# EAGLE design untitled (EAGLE 6.3)
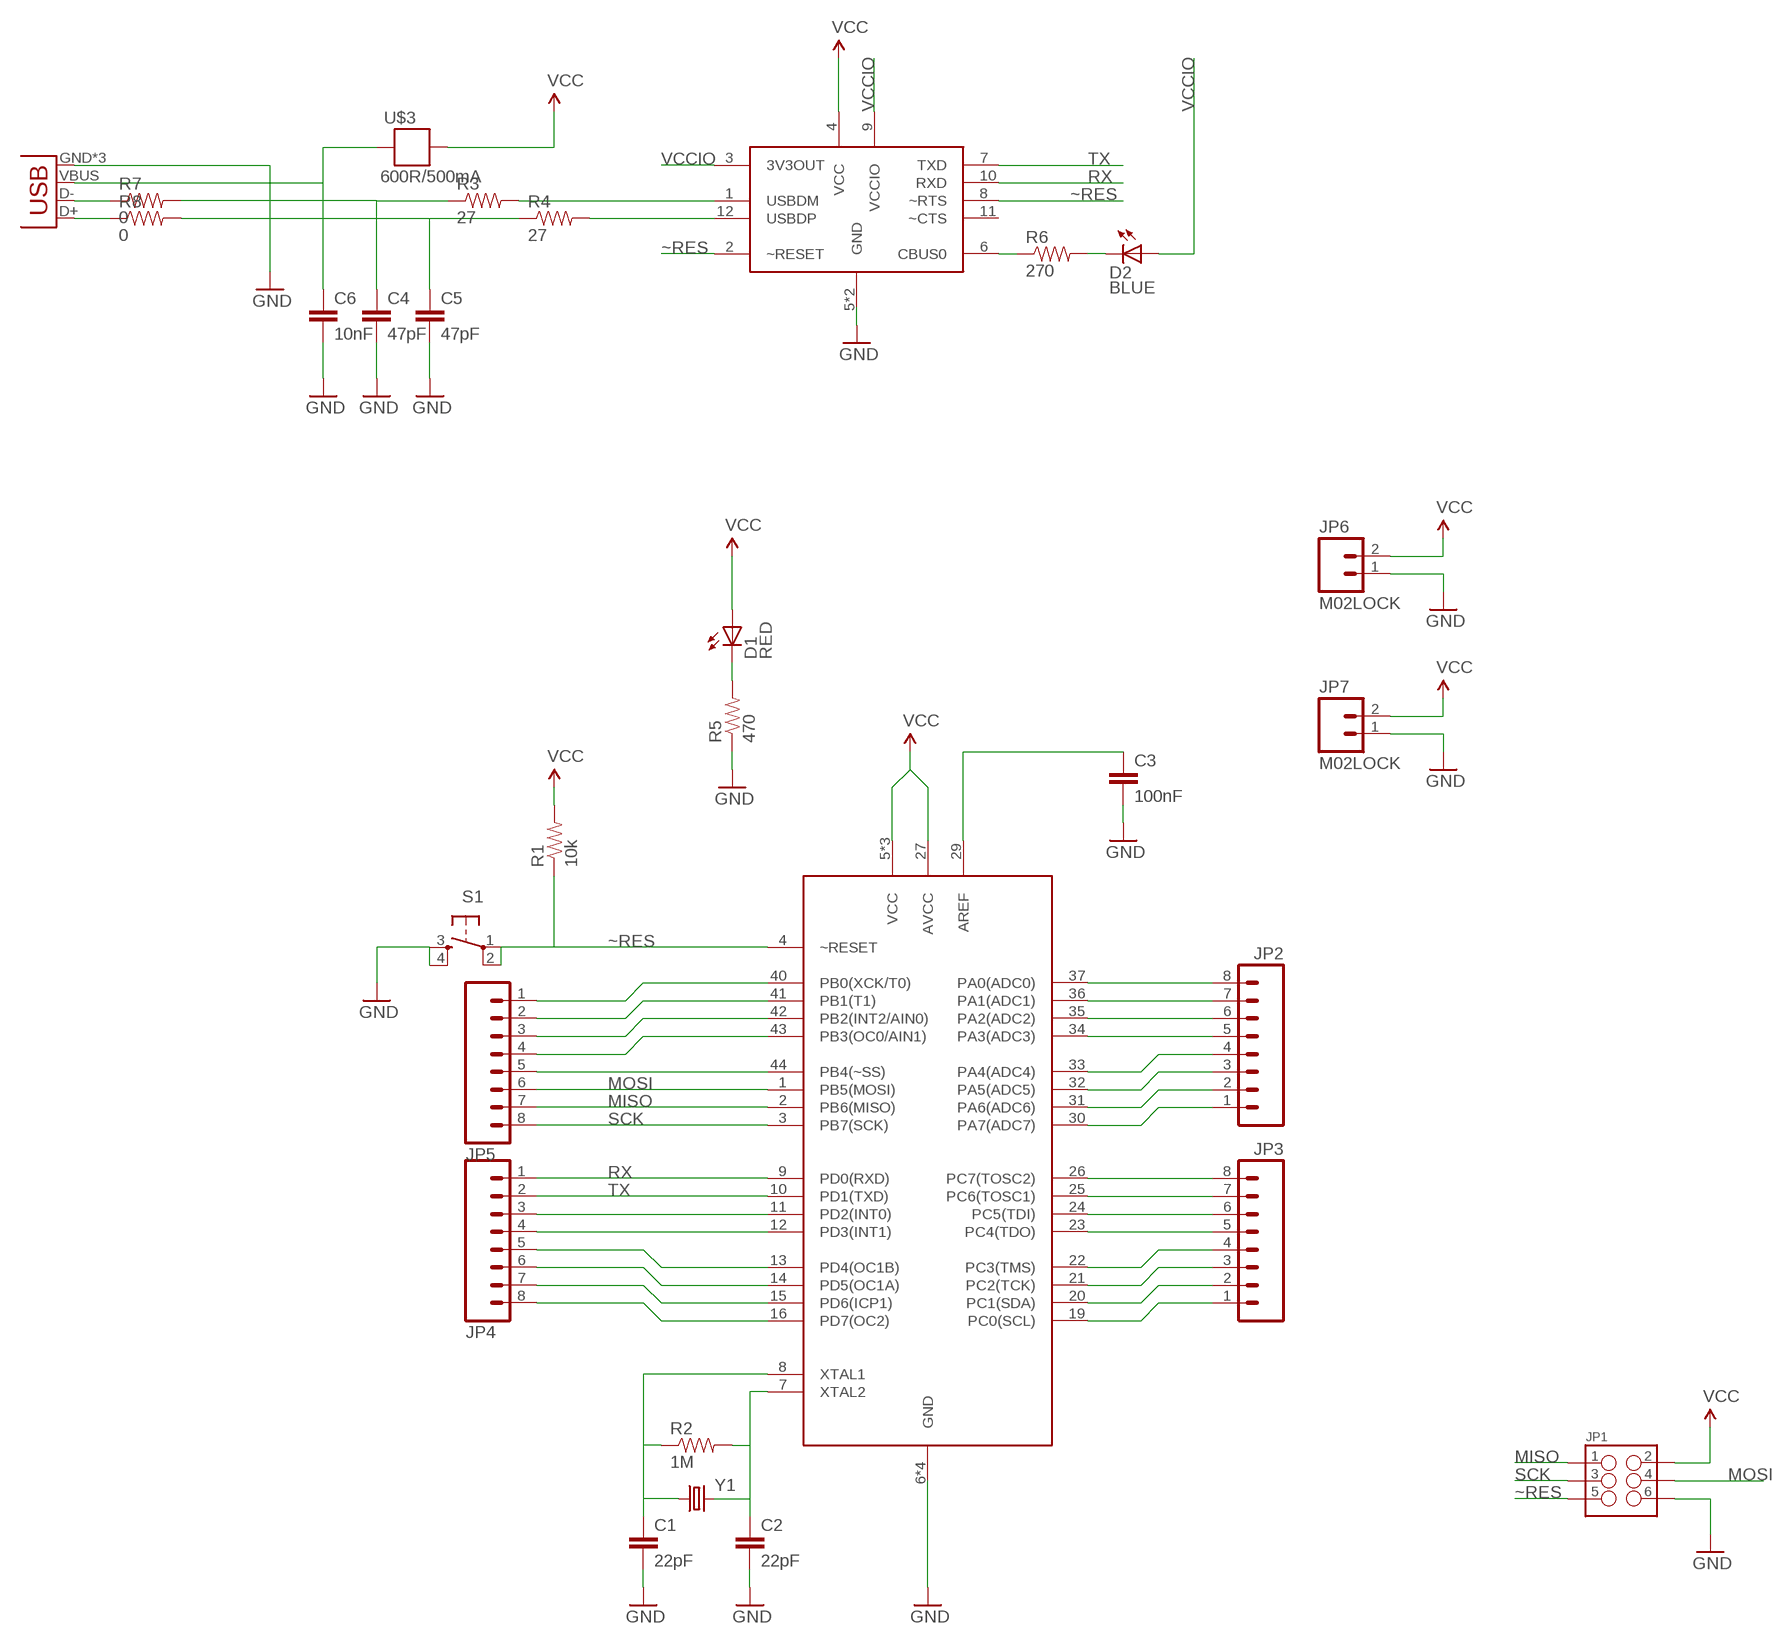
[diagram p0: schematic, sheet 1]

## Parts
C1  22pF  22PF-50V-5%(0603)  [0603-CAP]
C2  22pF  22PF-50V-5%(0603)  [0603-CAP]
C3  100nF  CAP0603-CAP  [0603-CAP]
C4  47pF  CAP0603-CAP  [0603-CAP]
C5  47pF  CAP0603-CAP  [0603-CAP]
C6  10nF  CAP0603-CAP  [0603-CAP]
D1  RED  LED-RED0603  [LED-0603]
D2  BLUE  LED-BLUE0603  [LED-0603]
JP1  M03X2  [2X3_SMD]
JP2  M081X08  [1X08]
JP3  M081X08  [1X08]
JP4  M081X08  [1X08]
JP5  M081X08  [1X08]
JP6  M02LOCK  [1X02_LOCK]
JP7  M02LOCK  [1X02_LOCK]
R1  10k  10K-1%RES-00824  [0603-RES]
R2  1M  1M-1%  [0603-RES]
R3  27  RESISTOR0603-RES  [0603-RES]
R4  27  RESISTOR0603-RES  [0603-RES]
R5  470  10K-1%RES-00824  [0603-RES]
R6  270  RESISTOR0603-RES  [0603-RES]
R7  0  RESISTOR0603-RES  [0603-RES]
R8  0  RESISTOR0603-RES  [0603-RES]
S1  TAC_SWITCHSMD  [TACTILE_SWITCH_SMD]
U1  USB-MICROB  [USB-MICROB]
U$1  ATMEGA16QFP  [44-QFP_0.8]
U$2  FTDI_FT234XD  [DFN12-3X3]
U$3  600R/500mA  FB  [0603]
Y1  CRYSTAL10.5X4.8  [CRYSTAL-SMD-10.5X4.8-2PIN]

## Nets
D-: R7.1 U1.D-
D=: R8.1 U1.D+
GND: C1.2 C2.2 C3.2 C4.2 C5.2 C6.2 JP1.6 JP6.1 JP7.1 R5.1 S1.3 S1.4 U1.GND U1.MT1(GND) U1.MT2(GND) U$1.6(GND) U$1.18(GND) U$1.28(GND) U$1.39(GND) U$2.5(GND) U$2.PAD(GND)
MISO: JP1.1 JP5.7 U$1.2(PB6(MISO))
MOSI: JP1.4 JP5.6 U$1.1(PB5(MOSI))
N$3: D1.C R5.2
N$5: C6.1 U1.VBUS U$3.2
N$7: C3.1 U$1.29(AREF)
N$9: R6.1 U$2.6(CBUS0)
N$10: D2.C R6.2
PA0: JP2.8 U$1.37(PA0(ADC0))
PA1: JP2.7 U$1.36(PA1(ADC1))
PA2: JP2.6 U$1.35(PA2(ADC2))
PA3: JP2.5 U$1.34(PA3(ADC3))
PA4: JP2.4 U$1.33(PA4(ADC4))
PA5: JP2.3 U$1.32(PA5(ADC5))
PA6: JP2.2 U$1.31(PA6(ADC6))
PA7: JP2.1 U$1.30(PA7(ADC7))
PB0: JP5.1 U$1.40(PB0(XCK/T0))
PB1: JP5.2 U$1.41(PB1(T1))
PB2: JP5.3 U$1.42(PB2(INT2/AIN0))
PB3: JP5.4 U$1.43(PB3(OC0/AIN1))
PB4: JP5.5 U$1.44(PB4(~SS))
PC2: JP3.3 U$1.21(PC2(TCK))
PC3: JP3.4 U$1.22(PC3(TMS))
PC4: JP3.5 U$1.23(PC4(TDO))
PC5: JP3.6 U$1.24(PC5(TDI))
PC6: JP3.7 U$1.25(PC6(TOSC1))
PC7: JP3.8 U$1.26(PC7(TOSC2))
PD2: JP4.3 U$1.11(PD2(INT0))
PD3: JP4.4 U$1.12(PD3(INT1))
PD4: JP4.5 U$1.13(PD4(OC1B))
PD5: JP4.6 U$1.14(PD5(OC1A))
PD6: JP4.7 U$1.15(PD6(ICP1))
PD7: JP4.8 U$1.16(PD7(OC2))
RX: JP4.1 U$1.9(PD0(RXD)) U$2.10(RXD)
SCK: JP1.3 JP5.8 U$1.3(PB7(SCK))
SCL: JP3.1 U$1.19(PC0(SCL))
SDA: JP3.2 U$1.20(PC1(SDA))
TX: JP4.2 U$1.10(PD1(TXD)) U$2.7(TXD)
USB_N: R3.2 U$2.1(USBDM)
USB_P: R4.2 U$2.12(USBDP)
USBDR_N: C4.1 R3.1 R7.2
USBDR_P: C5.1 R4.1 R8.2
VCC: D1.A JP1.2 JP6.2 JP7.2 R1.2 U$1.5(VCC) U$1.17(VCC) U$1.27(AVCC) U$1.38(VCC) U$2.4(VCC) U$3.1
VCCIO: D2.A U$2.3(3V3OUT) U$2.9(VCCIO)
XTAL1: C1.1 R2.1 U$1.8(XTAL1) Y1.P$1
XTAL2: C2.1 R2.2 U$1.7(XTAL2) Y1.P$2
~RES: JP1.5 R1.1 S1.1 S1.2 U$1.4(~RESET) U$2.2(~RESET) U$2.8(~RTS)
Unconnected: U$2.11(~CTS)

## Library data of the parts
C1 C2 = SparkFun-Capacitors:22PF-50V-5%(0603): CAP-07876; PROD_ID: CAP-07876
C3-C6 = SparkFun-Capacitors:CAP: Capacitor Standard 0603 ceramic capacitor, and 0.1" leaded capacitor.
D1 = SparkFun-LED:LED-RED: Assorted Red LEDs LilyPad 1206- DIO-09912 1206- DIO-00809 0603- DIO-00819; PROD_ID: DIO-00819
D2 = SparkFun-LED:LED-BLUE: Blue LEDs for production use Various blue LEDs stocked by SparkFun production 0603 - DIO-08575 Rebel - DIO-09553 1206 - DIO-09911; PROD_ID: DIO-08575
JP1 = SparkFun-Connectors:M03X2: 2x3 .1" header. Shrouded, with keying- CONN-10681 SMT- CONN-11415 Pogo pins- HW-11044; PROD_ID: CONN-11290
JP2-JP5 = SparkFun-Connectors:M08: Header 8 Standard 8-pin 0.1" header. Use with straight break away headers (SKU : PRT-00116), right angle break away headers (PRT-00553), swiss pins (PRT-00743), machine pins (PRT-00117), and female headers (PRT-00115).
JP6 JP7 = SparkFun-Connectors:M02: Standard 2-pin 0.1" header. Use with - straight break away headers ( PRT-00116) - right angle break away headers (PRT-00553) - swiss pins (PRT-00743) - machine pins (PRT-00117) - female headers (PRT-00115) Molex polarized connector foot print use with: PRT-08233 with associated crimp pins and housings. 2.54_SCREWTERM for use with PRT-10571. 3.5mm Screw Terminal footprints for PRT-08084 5mm Screw Terminal footprints for use with PRT-08433
R1 = SparkFun-Resistors:10K-1%: 10k-ohm SMT 1/10W - 1% (0603) RES-00824; PROD_ID: RES-00824
R2 = SparkFun-Resistors:1M-1%: 1M-ohm SMT 1/10W - 1% (0603) RES-07868; PROD_ID: RES-07868
R3 R4 R7 R8 = SparkFun-Passives:RESISTOR: Resistor Basic schematic elements and footprints for 0603, 1206, and PTH resistors.
R5 = SparkFun-Resistors:10K-1%: 10k-ohm SMT 1/10W - 1% (0603) RES-00824; PROD_ID: RES-00824; VALUE: 10k
R6 = SparkFun-Resistors:RESISTOR: Resistor Basic schematic elements and footprints for 0603, 1206, and PTH resistors.
S1 = SparkFun-Electromechanical:TAC_SWITCH: Momentary Switch Button commonly used for reset or general input. Spark Fun Electronics SKU : COM-00097 SMT- SWCH-08247; PROD_ID: SWCH-08247
U1 = SparkFun-Connectors:USB: USB Connectors USB-B-PTH is fully proven SKU : PRT-00139/CONN-08278 USB-miniB is fully proven SKU : PRT-00587 USB-A-PCB is untested. USB-A-H is throughly reviewed, but untested. Spark Fun Electronics SKU : PRT-00437 USB-B-SMT is throughly reviewed, but untested. Needs silkscreen touching up. USB-A-S has not been used/tested USB-MB-H has not been used/tested USB-MICROB has been used. CONN-09505; PROD_ID: CONN-09505
U$1 = Strutz Electronic Industries:ATMEGA16
U$2 = Strutz Electronic Industries:FTDI_FT234XD
U$3 = SparkFun-Passives:FB
Y1 = SparkFun-FreqCtrl:CRYSTAL: Various standard crystals. Proven footprints. Spark Fun Electronics SKU : COM-00534

## Board
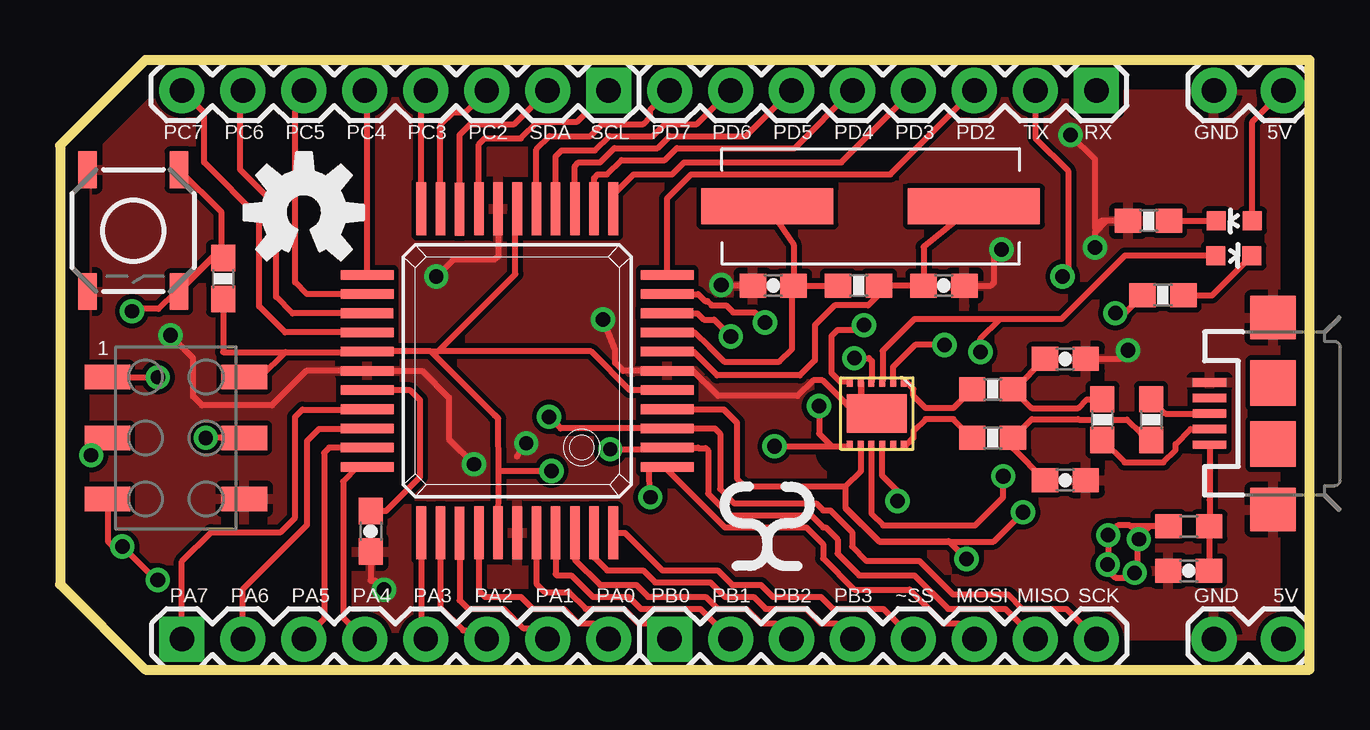
[diagram p1: board, top side]
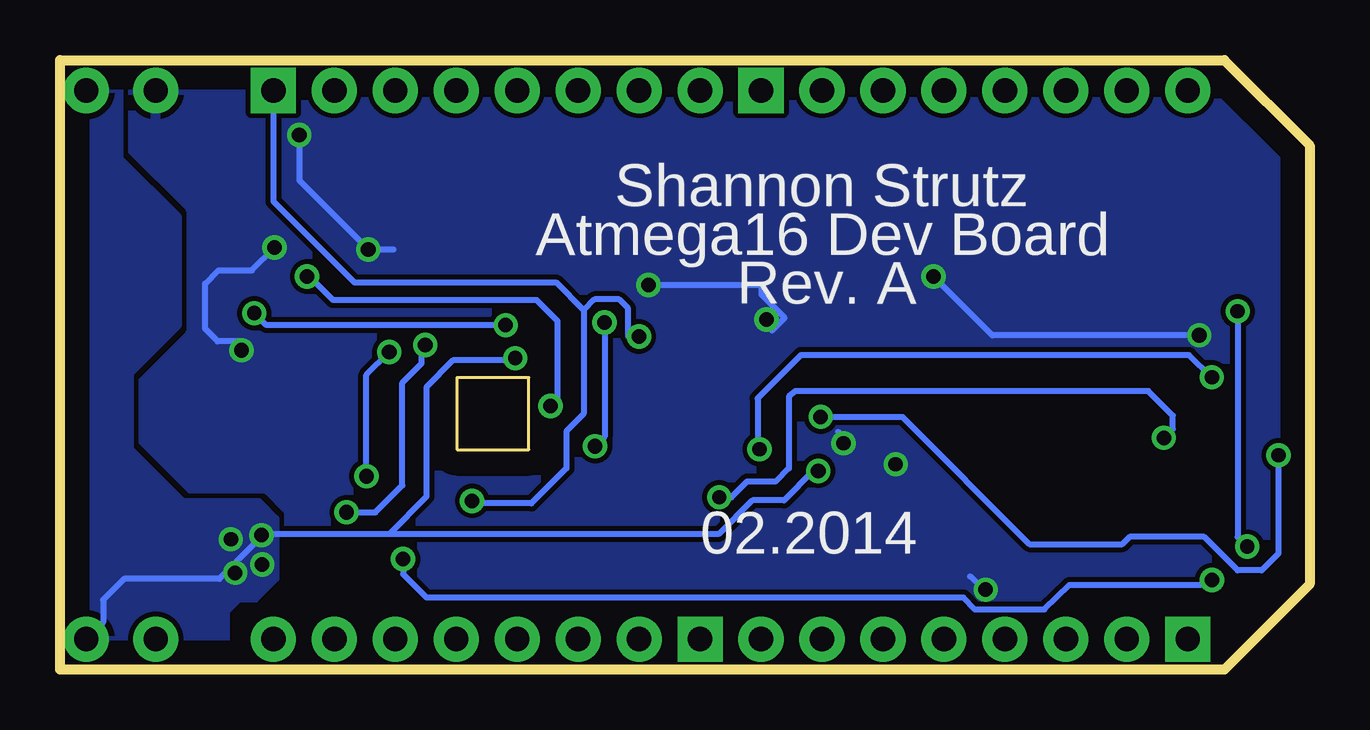
[diagram p2: board, bottom side, seen from below]

Size 52.07 x 25.4 mm. Coordinates in mm from the lower left corner, seen from the top.
Outline: 0,3.56 3.56,0 52.07,0 52.07,25.4 3.56,25.4 0,21.84 0,3.56
Copper layers (1*16): Top 0.035mm / dielectric 1.5mm / Bottom 0.035mm
Design rules "default": minimum track width 10mil, minimum drill 24mil, track to track 8mil, track to pad 8mil, pad to pad 8mil, via to via 8mil, smd to smd 8mil, copper to edge 40mil, drill to drill 8mil, minimum pad ring 10mil, minimum via ring 8mil, stop-mask expansion 4mil, vias tented up to drill 0mil, thermal gap 10mil

### Footprints (pad centres in the part's own frame; a part is rotated, then mirrored left to right if it is on the bottom)
0603-CAP = smd 1.1 x 1: 1 -0.85,0; 2 0.85,0
LED-0603 = smd 0.8 x 0.8: A 0,-0.75; C 0,0.75
2X3_SMD = smd 1.02 x 1.9: 1 -2.54,-2.85; 2 -2.54,2.85; 3 0,-2.85; 4 0,2.85; 5 2.54,-2.85; 6 2.54,2.85
1X08 = drill 1.016 pad 1.88 square: 1 0,0 | drill 1.016 pad 1.88: 2 2.54,0; 3 5.08,0; 4 7.62,0; 5 10.16,0; 6 12.7,0; 7 15.24,0; 8 17.78,0
1X02_LOCK = drill 1.016 pad 1.88: 1 -0.178,0; 2 2.718,0
0603-RES = smd 1.1 x 1: 1 -0.85,0; 2 0.85,0
TACTILE_SWITCH_SMD = smd 1.524 x 0.762: 1 -2.54,1.905; 2 2.54,1.905; 3 -2.54,-1.905; 4 2.54,-1.905
USB-MICROB = smd 0.35 x 1.4: D+ 0,2.65; D- -0.65,2.65; GND 1.3,2.65; ID 0.65,2.65; VBUS -1.3,2.65 | smd 1.8 x 1.9: MT1 -4,0; MT2 4,0 | smd 1.9 x 1.9: P$1 -1.27,0; P$2 1.27,0
44-QFP_0.8 = smd 0.4 x 2.2: 1 -4,-6.25; 2 -3.2,-6.25; 3 -2.4,-6.25; 4 -1.6,-6.25; 5 -0.8,-6.25; 6 0,-6.25; 7 0.8,-6.25; 8 1.6,-6.25; 9 2.4,-6.24; 10 3.2,-6.25; 11 4,-6.25; 23 4,6.25; 24 3.2,6.25; 25 2.4,6.26; 26 1.6,6.25; 27 0.8,6.25; 28 0,6.25; 29 -0.8,6.25; 30 -1.6,6.25; 31 -2.4,6.25; 32 -3.2,6.25; 33 -4,6.25 | smd 2.2 x 0.4: 12 6.75,-4; 13 6.75,-3.2; 14 6.75,-2.4; 15 6.75,-1.6; 16 6.75,-0.8; 17 6.75,0; 18 6.75,0.8; 19 6.75,1.6; 20 6.74,2.4; 21 6.75,3.2; 22 6.75,4; 34 -6.75,4; 35 -6.75,3.2; 36 -6.76,2.4; 37 -6.75,1.6; 38 -6.75,0.8; 39 -6.75,0; 40 -6.75,-0.8; 41 -6.75,-1.6; 42 -6.75,-2.4; 43 -6.75,-3.2; 44 -6.75,-4
DFN12-3X3 = smd 0.4 x 0.25: 1 -1.325,1.125; 2 -1.325,0.675; 3 -1.325,0.225; 4 -1.325,-0.225; 5 -1.325,-0.675; 6 -1.325,-1.125; 7 1.325,-1.125; 8 1.325,-0.675; 9 1.325,-0.225; 10 1.325,0.225; 11 1.325,0.675; 12 1.325,1.125 | smd 1.6 x 2.5: PAD 0,0
0603 = smd 1.1 x 1: 1 -0.85,0; 2 0.85,0
CRYSTAL-SMD-10.5X4.8-2PIN = smd 5.5 x 1.5: P$1 -4.3,0; P$2 4.3,0

### Placement (x,y rotation side)
C1  29.72,16 180 top
C2  36.83,16 0 top
C3  12.94,5.77 270 top
C4  41.89,12.94 0 top
C5  41.89,7.89 0 top
C6  47.03,4.12 180 top
D1  48.93,18.7 90 top
D2  48.91,17.25 270 top
JP1  4.83,9.65 270 top
JP2  5.08,1.27 0 top
JP3  22.86,24.13 180 top
JP4  43.18,24.13 180 top
JP5  25.4,1.27 0 top
JP6  48.26,1.27 0 top
JP7  48.26,24.13 0 top
R1  6.8,16.29 270 top
R2  33.27,16 0 top
R3  38.86,11.68 180 top
R4  38.86,9.65 180 top
R5  45.36,18.7 0 top
R6  45.96,15.59 0 top
R7  43.43,10.41 90 top
R8  45.47,10.41 270 top
S1  3.05,18.29 270 top
U1  50.55,10.67 90 top
U$1  19.05,12.45 90 top
U$2  34.04,10.67 270 top
U$3  47.04,5.96 0 top
U$4  [OSHW-LOGO-M]  10.16,19.05 0 top
Y1  33.77,19.3 0 top

### Tracks (layer width: path | path; a pad name or v marks a point on that pad's centre or on a via)
D-
  Top 0.254: R7.1 44.36,8.64 45.97,8.64 46.48,9.14 46.48,9.4 47.1,10.02 U1.D-
D=
  Top 0.254: R8.1 46.06,10.67 U1.D+
GND  (via drill 0.6 pad 0.2, 0.61 pad 0.2)
  Top 0.254: U$2.PAD arc-90 33.36,11.34 U$2.5 33.38,11.98 33.38,11.03 32.8,11.03 31.77,12.05 31.38,12.05 30.73,11.41 27.43,11.41 26.35,12.48 25.33,12.48 U$1.6 23.46,12.45 23.12,12.78 23.12,13.33 v22.62,14.58 | C3.2 12.94,3.71 12.95,3.7 13.12,3.7 v13.5,3.33 | 19.05,8.88 v19.43,9.43 | v17.25,8.55 16.2,9.61 16.2,11.33 15.08,12.45 U$1.28 10.27,12.45 8.82,11.01 5.92,11.01 5.55,11.38 5.55,12.98 v4.6,13.93 | U$1.18 18.25,17.23 18.1,17.08 16.38,17.08 v15.68,16.38 | C1.2 27.58,16 v27.55,16.03 | C2.2 38.8,16 38.92,16.13 38.92,17.21 v39.23,17.5 | C4.2 44.14,12.94 v44.5,13.3 | R5.1 43.6,18.7 | 43.6,18.7 43.39,18.7 43.12,18.43 43.12,21.25 v42.1,22.28 | v43.12,17.58 43.12,18.22 43.6,18.7
  Bottom 0.254: v13.5,3.33 13.6,3.33 14.15,3.88 | v19.43,9.43 19.43,9.68 19.65,9.91 | v17.25,8.55 17.25,8.48 17.1,8.33 | 15.8,16.36 15.78,16.38 v15.68,16.38 13.22,13.93 v4.6,13.93 | v22.62,14.58 22.4,14.13 21.88,14.66 22.85,15.63 22.85,16.03 v27.55,16.03 | 38.17,17.5 v39.23,17.5 42.1,20.38 v42.1,22.28 | v44.5,13.3 44.5,13.63 44.45,13.68 45.5,13.68 46.02,14.21 46.02,16.08 45.48,16.63 44.08,16.63 v43.12,17.58
  pour Bottom (rank 6): 52.07,0 52.07,25.4 4.32,25.4 3.56,25.4 0,21.84 0,3.56 3.56,0
  pour Top (rank 6): 0,21.84 0,3.56 3.56,0 52.07,0 52.07,25.4 3.56,25.4
MISO  (via drill 0.6 pad 0.2)
  Top 0.254: JP5.7 39.38,2.53 37,2.53 35.6,3.93 33.3,3.93 32.4,4.83 32.4,5.43 31.9,5.93 31.8,5.93 31.3,6.43 27.9,6.43 27,7.33 27,9.13 26.9,9.23 26.6,9.23 26.58,9.25 U$1.2 25.23,9.18 v22.93,9.18 | JP1.1 v4.08,12.18 4.08,12.21
  Bottom 0.254: v4.08,12.18 5.03,13.11 21.2,13.11 23,11.3 23,9.26 v22.93,9.18
MOSI  (via drill 0.6 pad 0.2)
  Top 0.254: JP5.6 37.44,1.93 36.8,1.93 35.4,3.33 33.1,3.33 31.8,4.63 31.8,5.23 31.1,5.93 27.7,5.93 25.3,8.33 U$1.1 24.54,8.45 v24.6,7.18 | JP1.4 v6.08,9.66
  Bottom 0.254: v6.08,9.66 5.7,10.03 5.7,10.58 6.72,11.61 21.43,11.61 21.7,11.38 21.7,8.38 22.25,7.83 23.45,7.83 24.1,7.18 v24.6,7.18
N$3
  Top 0.254: R5.2 D1.C
N$5
  Top 0.254: U1.VBUS 47.9,7.06 C6.1 47.88,5.84 U$3.2
N$7
  Top 0.254: C3.1 13.59,6.62 15,8.03 15,11.23 14.6,11.63 12.82,11.63 U$1.29
N$9  (via drill 0.6 pad 0.2)
  Top 0.254: v43.98,14.86 44.37,14.86 R6.1 | U$2.6 32.51,11.99 32.15,12.36 32.15,13.91 32.4,14.16 33.3,14.16 v33.5,14.36
  Bottom 0.254: v33.5,14.36 43.48,14.36 v43.98,14.86
N$10
  Top 0.254: R6.2 48,15.59 D2.C
PA0
  Top 0.254: U$1.37 17.45,3.28 17.7,3.03 19.2,3.03 19.7,2.53 21,2.53 21.6,1.93 22.2,1.93 JP2.8
PA1
  Top 0.254: U$1.36 16.65,2.88 17,2.53 18.5,2.53 19.3,1.73 19.86,1.73 JP2.7
PA2
  Top 0.254: U$1.35 15.85,2.58 16.8,1.63 17.42,1.63 JP2.6
PA3
  Top 0.254: U$1.34 15.05,1.46 JP2.5
PA4
  Top 0.254: U$1.33 12.42,8.45 11.8,7.83 11.8,2.17 JP2.4
PA5
  Top 0.254: U$1.32 11.22,9.25 11,9.03 11,2.11 JP2.3
PA6
  Top 0.254: JP2.2 7.62,3.35 10.3,6.03 10.3,9.53 10.8,10.03 12.78,10.03 U$1.31
PA7
  Top 0.254: JP2.1 5.08,4.51 6.3,5.73 9.2,5.73 9.8,6.33 9.8,10.53 10.1,10.83 12.78,10.83 U$1.30
PB0
  Top 0.254: U$1.40 19.85,3.58 20.2,3.23 21.2,3.23 21.9,2.53 23.5,2.53 24.1,1.93 24.74,1.93 JP5.1
PB1
  Top 0.254: U$1.41 20.65,3.98 20.7,3.93 21.3,3.93 22.2,3.03 23.7,3.03 24.2,2.53 26.68,2.53 JP5.2
PB2
  Top 0.254: U$1.42 21.45,4.58 22.5,3.53 24,3.53 24.5,3.03 26.9,3.03 27.4,2.53 28.6,2.53 29.2,1.93 29.82,1.93 JP5.3
PB3
  Top 0.254: U$1.43 22.25,4.68 22.8,4.13 24.3,4.13 24.8,3.63 27.1,3.63 27.7,3.03 28.9,3.03 29.4,2.53 31.1,2.53 31.7,1.93 32.36,1.93 JP5.4
PB4
  Top 0.254: U$1.44 23.53,5.7 25.1,4.13 27.4,4.13 28,3.53 29.2,3.53 29.7,3.03 31.7,3.03 32.2,2.53 34.3,2.53 JP5.5
PC2
  Top 0.254: U$1.21 15.85,22.68 16.4,23.23 16.88,23.23 JP3.3
PC3
  Top 0.254: U$1.22 15.05,23.94 JP3.4
PC4
  Top 0.254: U$1.23 12.8,24.03 JP3.5
PC5
  Top 0.254: U$1.24 10.28,15.65 9.8,16.13 9.8,23.77 JP3.6
PC6
  Top 0.254: U$1.25 9.68,14.85 9,15.53 9,19.33 7.5,20.83 7.5,24.01 JP3.7
PC7
  Top 0.254: U$1.26 9.38,14.05 8.3,15.13 8.3,18.83 6,21.13 6,23.21 JP3.8
PD2
  Top 0.254: U$1.11 25.3,19.63 26.3,20.63 34.6,20.63 JP4.3
PD3
  Top 0.254: U$1.12 23.05,19.78 23.9,20.63 25.5,20.63 26,21.13 32.56,21.13 JP4.4
PD4
  Top 0.254: U$1.13 22.25,20.48 22.4,20.63 22.8,20.63 23.4,21.23 25.2,21.23 25.7,21.73 30.62,21.73 JP4.5
PD5
  Top 0.254: U$1.14 21.45,20.98 21.6,21.13 22.5,21.13 23.1,21.73 24.9,21.73 25.4,22.23 28.58,22.23 JP4.6
PD6
  Top 0.254: U$1.15 20.65,21.38 20.9,21.63 22.3,21.63 22.9,22.23 24.7,22.23 25.2,22.73 26.54,22.73 JP4.7
PD7
  Top 0.254: U$1.16 19.85,21.68 20.4,22.23 22.1,22.23 22.6,22.73 24.3,22.73 24.6,23.03 24.6,23.33 JP4.8
RX  (via drill 0.61 pad 0.2)
  Top 0.254: U$1.9 26.56,14.85 26.82,14.58 27.25,14.58 v27.95,13.88 | v34.9,7.03 34.9,7.43 34.25,8.08 U$2.10
  Bottom 0.254: v27.95,13.88 28.38,13.88 28.4,13.91 28.4,15.05 28.77,15.43 29.8,15.43 30.25,14.98 | 30.25,14.98 30.25,10.66 30.98,9.93 30.98,8.38 32.42,6.93 34.8,6.93 v34.9,7.03 | JP4.1 43.18,19.51 39.8,16.13 31.4,16.13 30.25,14.98
SCK  (via drill 0.6 pad 0.2)
  Top 0.254: JP1.3 2.02,9.65 v1.3,8.93 | JP5.8 41.92,2.53 40.1,2.53 39.5,3.13 37.2,3.13 35.8,4.53 33.6,4.53 33,5.13 33,5.73 32.1,6.63 31.8,6.63 31.5,6.93 28.1,6.93 27.5,7.53 27.5,9.83 27.28,10.05 U$1.3 20.86,10.05 v20.38,10.53
  Bottom 0.254: v1.3,8.93 1.3,4.83 2,4.13 3,4.13 4.4,5.53 7.5,5.53 7.8,5.23 11.68,5.23 16.98,10.53 v20.38,10.53
SCL
  Top 0.254: U$1.19 17.45,21.88 17.7,22.13 19.2,22.13 19.9,22.83 21.56,22.83 JP3.1
SDA
  Top 0.254: U$1.20 16.65,22.28 17.1,22.73 18.92,22.73 JP3.2
TX  (via drill 0.61 pad 0.2)
  Top 0.254: U$1.10 26.58,15.65 26.88,15.36 26.98,15.36 27.15,15.18 27.75,15.18 28.05,14.88 28.95,14.88 v29.38,14.46 | v29.77,9.3 32.15,9.3 | 32.15,9.3 32.87,9.3 U$2.7 | JP4.2 40.64,22.14 42,20.78 42,16.61 v41.77,16.38 | v31.62,10.98 31.62,9.83 32.15,9.3
  Bottom 0.254: v29.38,14.46 29.38,9.71 v29.77,9.3 | v41.77,16.38 41.67,16.38 40.7,15.41 32.23,15.41 31.35,14.53 31.35,11.26 v31.62,10.98
USB_N
  Top 0.254: R3.2 37.23,10.9 36.07,10.9 35.56,11.41 35.56,11.68 35.25,11.99 U$2.1
USB_P
  Top 0.254: R4.2 37.23,10.44 36.07,10.44 35.56,9.93 35.56,9.65 35.25,9.34 U$2.12
USBDR_N
  Top 0.254: R7.2 42.78,11.26 42.42,10.9 40.5,10.9 R3.1 39.78,11.68 C4.1
USBDR_P
  Top 0.254: R8.2 45.05,9.82 44.45,10.41 42.44,10.41 42.42,10.44 40.5,10.44 R4.1 39.71,9.22 C5.1
VCC  (via drill 0.6 pad 0.2, 0.61 pad 0.2)
  Top 0.254: JP1.2 8.36,12.19 9.4,13.23 | 9.4,13.23 12.78,13.23 U$1.27 15.45,13.26 | R1.2 6.8,13.23 9.4,13.23 | U$1.38 18.27,8.08 | 18.27,8.08 18.25,10.46 | 18.25,10.46 18.11,10.59 | 18.11,10.59 15.45,13.26 | 15.45,13.26 15.75,13.26 | 15.75,13.26 18.98,16.48 18.98,19.12 U$1.17 | 18.11,10.59 18.12,10.61 18.25,10.48 18.25,10.46 | D1.A 49.68,22.83 JP7.2 | U$3.1 44.62,5.96 44.58,6.01 44.08,6.01 v43.67,5.61 43.67,4.13 43.98,3.83 44.55,3.83 44.9,4.18 44.9,5.48 45.38,5.96 | v33.1,12.98 33.7,12.98 33.83,12.86 33.83,12.01 U$2.4 | 18.27,8.08 18.27,8.28 v20.48,8.28 | U$1.5 23.73,11.65 22.12,13.26 15.75,13.26
  Bottom 0.254: JP6.2 50.27,1.97 50.27,2.9 49.4,3.78 45.42,3.78 43.67,5.53 v43.67,5.61 43.65,5.63 39.57,5.65 | v33.1,12.98 33,12.88 35.7,12.88 36.8,11.76 36.8,7.21 38.33,5.65 39.57,5.65 | v20.48,8.28 20.68,8.28 21.9,7.05 23.23,7.05 24.63,5.65 39.57,5.65
  other vias: 44.95,5.43 43.65,4.38 44.77,4.03
  pour Bottom (rank 4): 52.08,0.03 52.08,25.41 49.55,25.41 49.55,21.3 47.12,18.88 47.12,14.33 49.12,12.33 49.12,9.21 46.95,7.03 43.77,7.03 43.05,6.3 43.05,3.78 43.92,2.9 44.62,2.9 45.12,2.4 45.12,0.46 45.58,0 52.05,0
VCCIO  (via drill 0.61 pad 0.2)
  Top 0.254: D2.A 44.37,17.25 41.73,14.61 39.17,14.61 | 39.17,14.61 35.6,14.61 34.27,13.28 34.27,12.01 U$2.3 | U$2.9 33.81,6.49 34.3,6.01 38.12,6.01 39.3,7.18 v39.3,8.05 | v38.35,13.23 38.35,13.78 39.17,14.61
  Bottom 0.254: v39.3,8.05 39.3,12.28 v38.35,13.23
XTAL1
  Top 0.254: C1.1 R2.1 | Y1.P$1 30.57,17.71 C1.1 | U$1.8 26.43,14.05 27.06,13.45 27.68,12.83 29.98,12.83 30.5,13.36 30.5,15.93 C1.1
XTAL2
  Top 0.254: Y1.P$2 35.98,17.61 C2.1 R2.2 34.12,15.63 33.67,15.18 32.27,15.18 31.45,14.36 31.45,12.88 30.82,12.26 27.38,12.26 26.38,13.26 U$1.7
~RES  (via drill 0.6 pad 0.2, 0.61 pad 0.2)
  Top 0.254: R1.1 6.73,17.53 | 6.73,17.53 S1.2 | 6.73,17.53 6.73,19.05 S1.1 | R1.1 6.7,17.53 4.9,15.73 4.8,15.73 4.1,15.03 3.1,15.03 v3,14.93 | JP1.5 2,6.83 2,5.33 2.2,5.13 v2.6,5.13 4,3.73 v4.08,3.73 | 28.2,10.28 27.63,10.85 U$1.4 27.66,10.85 28.2,10.3 28.2,10.28 | 28.2,10.28 28.2,7.96 28.52,7.63 32.7,7.63 | 32.7,7.63 32.73,7.63 | 33.36,8.27 33.38,8.28 33.38,9.33 U$2.8 33.36,8.27 | 33.36,8.27 32.73,7.63 | 32.73,7.63 32.73,7.61 | 32.73,6.76 32.73,6.73 34.12,5.33 38.9,5.33 v40.12,6.55 | v36.85,13.53 35.62,13.53 34.7,12.61 34.7,12 U$2.2 | R1.1 6.83,17.11 | 32.7,7.63 32.73,7.61 | 32.73,7.61 32.73,6.76 | 32.73,6.76 34.12,5.36 37.02,5.36 v37.77,4.61
  Bottom 0.254: v3,14.93 3,5.53 v2.6,5.13 | v40.12,6.55 38.92,6.55 37.8,7.68 37.8,11.96 37,12.76 37,13.38 v36.85,13.53 | v37.77,4.61 37.77,3.98 36.8,3.01 14.43,3.01 13.95,2.5 11.05,2.5 10,3.53 4.28,3.53 v4.08,3.73

### Text on the board
_tsilk: PC7 | PC6 | PC5 | PC4 | PC3 | PC2 | SDA | SCL | PD7 | PD6 | PD5 | PD4 | PD3 | PD2 | TX | RX | GND | 5V | 1 | PA7 | PA6 | PA5 | PA4 | PA3 | PA2 | PA1 | PA0 | PB0 | PB1 | PB2 | PB3 | ~SS | MOSI | MISO | SCK | GND | 5V
_bsilk: Shannon Strutz | Atmega16 Dev Board | Rev. A | 02.2014